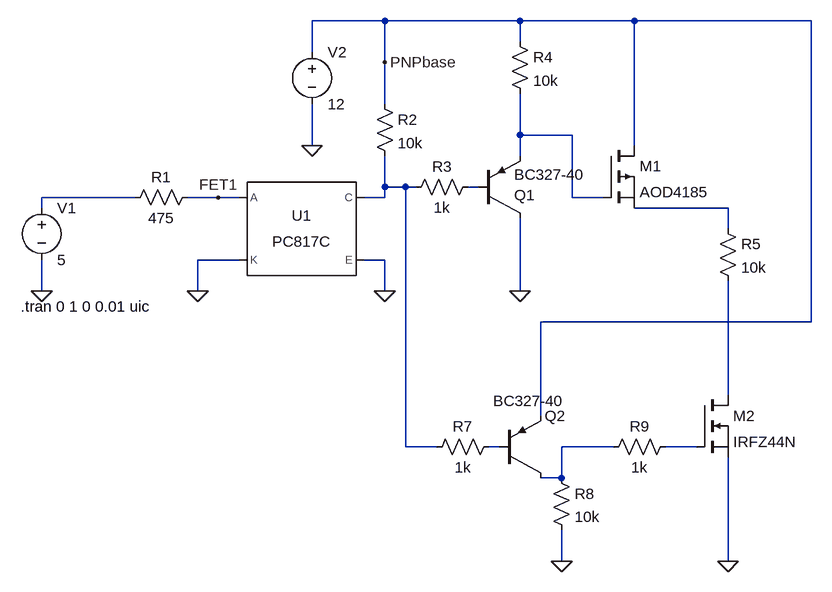
[diagram p0: schematic LTSpiceModel.asc]
LTSpiceModel.asc, the LTspice schematic file:
Version 4.1
SHEET 1 1032 804
WIRE 256 -160 144 -160
WIRE 464 -160 256 -160
WIRE 640 -160 464 -160
WIRE 912 -160 640 -160
WIRE 464 -128 464 -160
WIRE 144 -112 144 -160
WIRE 256 -96 256 -160
WIRE 256 -32 256 -96
WIRE 464 16 464 -48
WIRE 544 16 464 16
WIRE 144 32 144 -32
WIRE 640 32 640 -160
WIRE 464 48 464 16
WIRE 256 96 256 48
WIRE 288 96 256 96
WIRE 304 96 288 96
WIRE 400 96 384 96
WIRE -128 112 -272 112
WIRE 0 112 -48 112
WIRE 32 112 0 112
WIRE 256 112 256 96
WIRE 256 112 224 112
WIRE 544 112 544 16
WIRE 592 112 544 112
WIRE -272 128 -272 112
WIRE 784 128 640 128
WIRE 784 160 784 128
WIRE 32 208 -32 208
WIRE 256 208 224 208
WIRE -272 256 -272 208
WIRE -32 256 -32 208
WIRE 256 256 256 208
WIRE 464 256 464 144
WIRE 912 304 912 -160
WIRE 912 304 496 304
WIRE 784 416 784 240
WIRE 496 448 496 304
WIRE 288 496 288 96
WIRE 336 496 288 496
WIRE 432 496 416 496
WIRE 608 496 528 496
WIRE 736 496 688 496
WIRE 528 544 528 496
WIRE 528 544 496 544
WIRE 528 672 528 624
WIRE 784 672 784 512
FLAG -32 256 0
FLAG -272 256 0
FLAG 256 256 0
FLAG 144 32 0
FLAG 0 112 FET1
FLAG 256 -96 PNPbase
FLAG 464 256 0
FLAG 784 672 0
FLAG 528 672 0
SYMBOL Optos\\PC817C 128 160 R0
SYMATTR InstName U1
SYMBOL res -32 96 R90
WINDOW 0 0 56 VBottom 2
WINDOW 3 32 56 VTop 2
SYMATTR InstName R1
SYMATTR Value 475
SYMATTR SpiceLine tol=1 pwr=0.1
SYMBOL voltage -272 112 R0
WINDOW 123 0 0 Left 0
WINDOW 39 0 0 Left 0
SYMATTR InstName V1
SYMATTR Value 5
SYMBOL res 240 -48 R0
SYMATTR InstName R2
SYMATTR Value 10k
SYMBOL voltage 144 -128 R0
WINDOW 123 0 0 Left 0
WINDOW 39 0 0 Left 0
SYMATTR InstName V2
SYMATTR Value 12
SYMBOL res 400 80 R90
WINDOW 0 0 56 VBottom 2
WINDOW 3 32 56 VTop 2
SYMATTR InstName R3
SYMATTR Value 1k
SYMBOL res 448 -144 R0
SYMATTR InstName R4
SYMATTR Value 10k
SYMBOL pnp 400 144 M180
WINDOW 0 55 36 Left 2
WINDOW 3 55 67 Left 2
SYMATTR InstName Q1
SYMATTR Value BC327-40
SYMBOL pmos 592 32 R0
SYMATTR InstName M1
SYMATTR Value AOD4185
SYMBOL res 768 144 R0
SYMATTR InstName R5
SYMATTR Value 10k
SYMBOL pnp 432 544 M180
WINDOW 0 70 96 Left 2
WINDOW 3 -9 119 Left 2
SYMATTR InstName Q2
SYMATTR Value BC327-40
SYMBOL res 432 480 R90
WINDOW 0 0 56 VBottom 2
WINDOW 3 32 56 VTop 2
SYMATTR InstName R7
SYMATTR Value 1k
SYMBOL res 512 528 R0
SYMATTR InstName R8
SYMATTR Value 10k
SYMBOL res 704 480 R90
WINDOW 0 0 56 VBottom 2
WINDOW 3 32 56 VTop 2
SYMATTR InstName R9
SYMATTR Value 1k
SYMBOL nmos 736 416 R0
SYMATTR InstName M2
SYMATTR Value IRFZ44N
TEXT -304 280 Left 2 !.tran 0 1 0 0.01 uic

The netlist it stands for:
* LTSpiceModel.asc
X§U1 FET1 0 N002 0 PC817 Igain=2.3m  ; PC817C, pins A K C E
R1 FET1 N004 475 tol=1 pwr=0.1
V1 N004 0 5
R2 PNPbase N002 10k
V2 PNPbase 0 12
R3 N003 N002 1k
R4 PNPbase N001 10k
Q1 0 N003 N001 0 BC327-40
M1 PNPbase N001 N005 N005 AOD4185
R5 N005 N006 10k
Q2 N008 N007 PNPbase 0 BC327-40
R7 N007 N002 1k
R8 N008 0 10k
R9 N009 N008 1k
M2 N006 N009 0 0 IRFZ44N
.model NPN NPN
.model PNP PNP
.lib standard.bjt
.model NMOS NMOS
.model PMOS PMOS
.lib standard.mos
.tran 0 1 0 0.01 uic
.lib PC817.sub
.backanno
.end

* Results of the author's LTspice run, read from the files saved beside the schematic
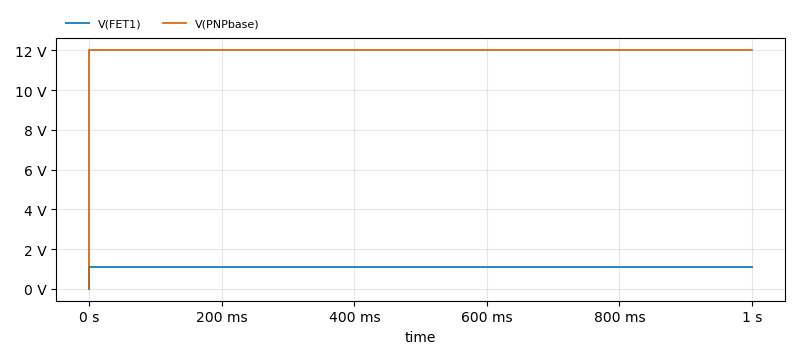
[diagram p1: Transient Analysis of LTSpiceModel.asc, plotted from the saved traces]
* Transient Analysis, 1 run:
*   V(FET1): min 0 V, max 1.085 V, average 1.084 V, rms 1.084 V, last 1.084 V
*   V(PNPbase): min 0 V, max 12 V, average 12 V, rms 12 V, last 12 V